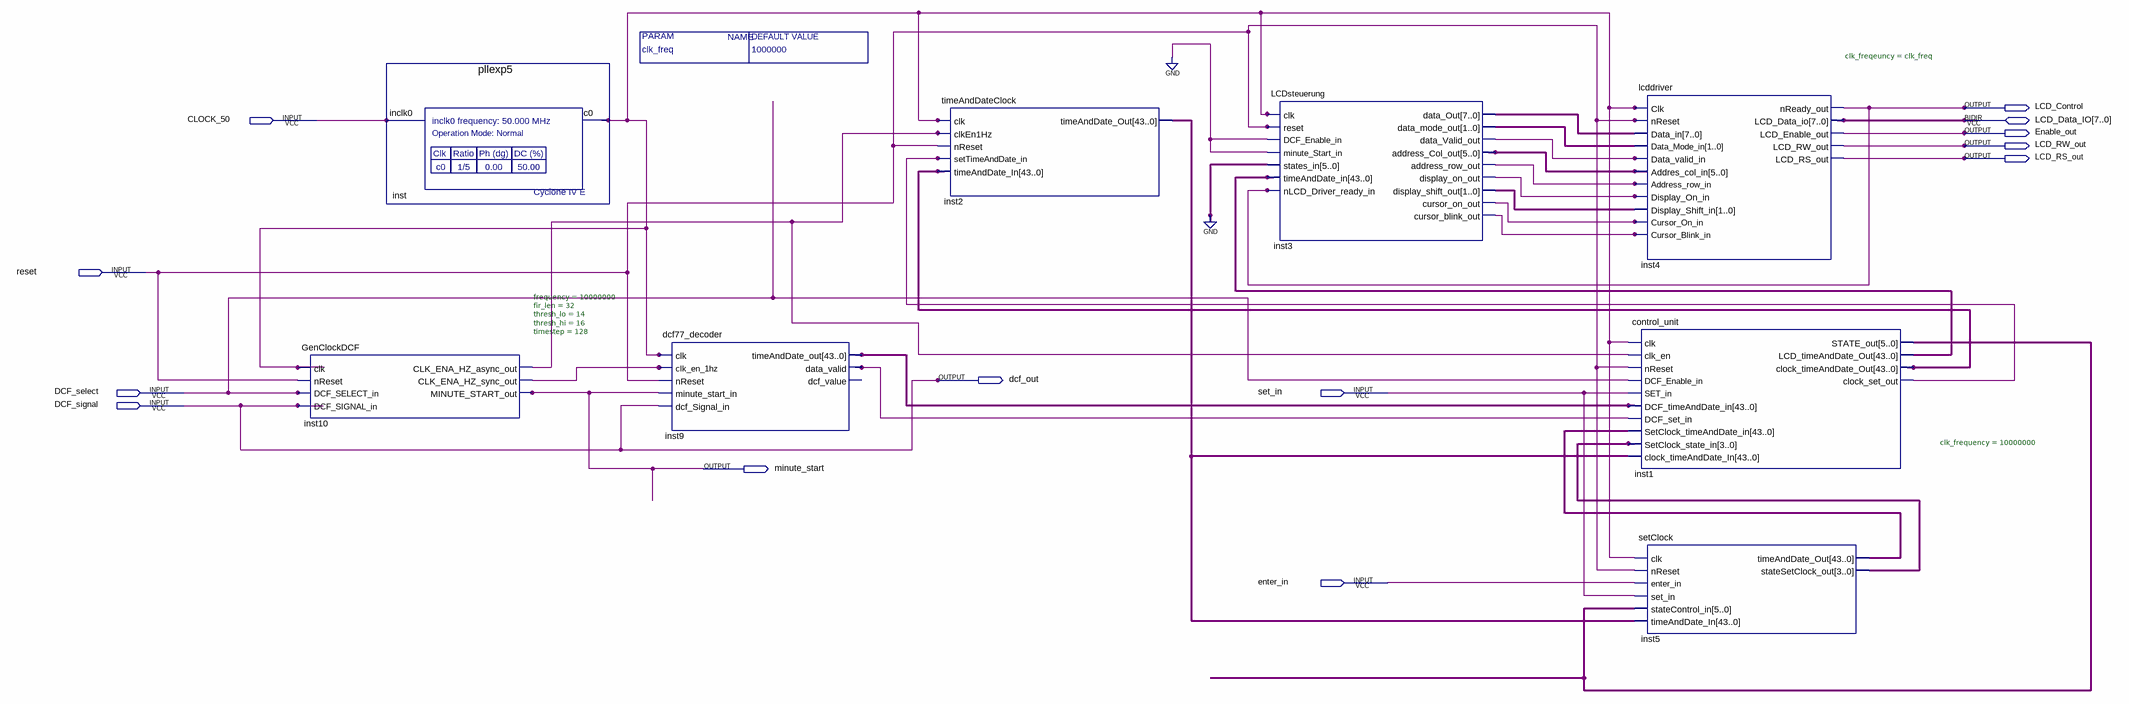
[diagram p0: schematic sheet]
// Quartus schematic experiment5_1.bdf as structural Verilog: 8 symbols, 13 pins
module experiment5_1 #(parameter clk_freq = 1000000) (
  input  CLOCK_50,
  input  reset,
  input  DCF_select,
  input  set_in,
  input  DCF_signal,
  input  enter_in,
  inout  [7:0] LCD_Data_IO,
  output LCD_Control,
  output Enable_out,
  output LCD_RW_out,
  output LCD_RS_out,
  output dcf_out,
  output minute_start
);

  wire inst1_clock_set_out, inst3_address_row_out, inst3_cursor_blink_out, inst3_cursor_on_out,
       inst3_data_valid_out, inst3_display_on_out, inst9_data_valid, inst10_clk_ena_hz_async_out,
       inst10_clk_ena_hz_sync_out, inst_c0;
  wire [1:0] inst3_data_mode_out, inst3_display_shift_out;
  wire [3:0] inst5_statesetclock_out;
  wire [5:0] inst1_state_out, inst3_address_col_out;
  wire [7:0] inst3_data_out;
  wire [43:0] inst1_clock_timeanddate_out, inst1_lcd_timeanddate_out, inst2_timeanddate_out,
       inst5_timeanddate_out, inst9_timeanddate_out;

  GenClockDCF #(.frequency(10000000), .fir_len(32), .thresh_lo(14), .thresh_hi(16), .timestep(128)) inst10 (
    .clk(inst_c0), .nReset(reset), .DCF_SELECT_in(DCF_select), .DCF_SIGNAL_in(DCF_signal),
    .CLK_ENA_HZ_async_out(inst10_clk_ena_hz_async_out), .CLK_ENA_HZ_sync_out(inst10_clk_ena_hz_sync_out),
    .MINUTE_START_out(minute_start));
  pllexp5 inst (.inclk0(CLOCK_50), .c0(inst_c0));
  dcf77_decoder inst9 (
    .clk(inst_c0), .clk_en_1hz(inst10_clk_ena_hz_sync_out), .nReset(reset), .minute_start_in(minute_start),
    .dcf_Signal_in(DCF_signal), .timeAndDate_out(inst9_timeanddate_out), .data_valid(inst9_data_valid));  // open: dcf_value
  timeAndDateClock inst2 (
    .clk(inst_c0), .clkEn1Hz(inst10_clk_ena_hz_async_out), .nReset(reset),
    .setTimeAndDate_in(inst1_clock_set_out), .timeAndDate_In(inst1_clock_timeanddate_out),
    .timeAndDate_Out(inst2_timeanddate_out));
  LCDsteuerung inst3 (
    .clk(inst_c0), .reset(reset), .DCF_Enable_in(1'b0), .minute_Start_in(1'b0), .states_in({6{1'b0}}),
    .timeAndDate_in(inst1_lcd_timeanddate_out), .nLCD_Driver_ready_in(LCD_Control),
    .data_Out(inst3_data_out), .data_mode_out(inst3_data_mode_out), .data_Valid_out(inst3_data_valid_out),
    .address_Col_out(inst3_address_col_out), .address_row_out(inst3_address_row_out),
    .display_on_out(inst3_display_on_out), .display_shift_out(inst3_display_shift_out),
    .cursor_on_out(inst3_cursor_on_out), .cursor_blink_out(inst3_cursor_blink_out));
  lcddriver #(.clk_freqeuncy(clk_freq)) inst4 (
    .Clk(inst_c0), .nReset(reset), .Data_in(inst3_data_out), .Data_Mode_in(inst3_data_mode_out),
    .Data_valid_in(inst3_data_valid_out), .Addres_col_in(inst3_address_col_out),
    .Address_row_in(inst3_address_row_out), .Display_On_in(inst3_display_on_out),
    .Display_Shift_in(inst3_display_shift_out), .Cursor_On_in(inst3_cursor_on_out),
    .Cursor_Blink_in(inst3_cursor_blink_out), .nReady_out(LCD_Control), .LCD_Enable_out(Enable_out),
    .LCD_RW_out(LCD_RW_out), .LCD_RS_out(LCD_RS_out), .LCD_Data_io(LCD_Data_IO));
  control_unit inst1 (
    .clk(inst_c0), .clk_en(inst10_clk_ena_hz_async_out), .nReset(reset), .DCF_Enable_in(DCF_select),
    .SET_in(set_in), .DCF_timeAndDate_in(inst9_timeanddate_out), .DCF_set_in(inst9_data_valid),
    .SetClock_timeAndDate_in(inst5_timeanddate_out), .SetClock_state_in(inst5_statesetclock_out),
    .clock_timeAndDate_In(inst2_timeanddate_out), .STATE_out(inst1_state_out),
    .LCD_timeAndDate_Out(inst1_lcd_timeanddate_out), .clock_timeAndDate_Out(inst1_clock_timeanddate_out),
    .clock_set_out(inst1_clock_set_out));
  setClock #(.clk_frequency(10000000)) inst5 (
    .clk(inst_c0), .nReset(reset), .enter_in(enter_in), .set_in(set_in), .stateControl_in(inst1_state_out),
    .timeAndDate_In(inst2_timeanddate_out), .timeAndDate_Out(inst5_timeanddate_out),
    .stateSetClock_out(inst5_statesetclock_out));

  assign dcf_out = DCF_signal;
endmodule
